# Altium schematic sheet PX4FMUv2.3_SCH4.SchDoc
size A4
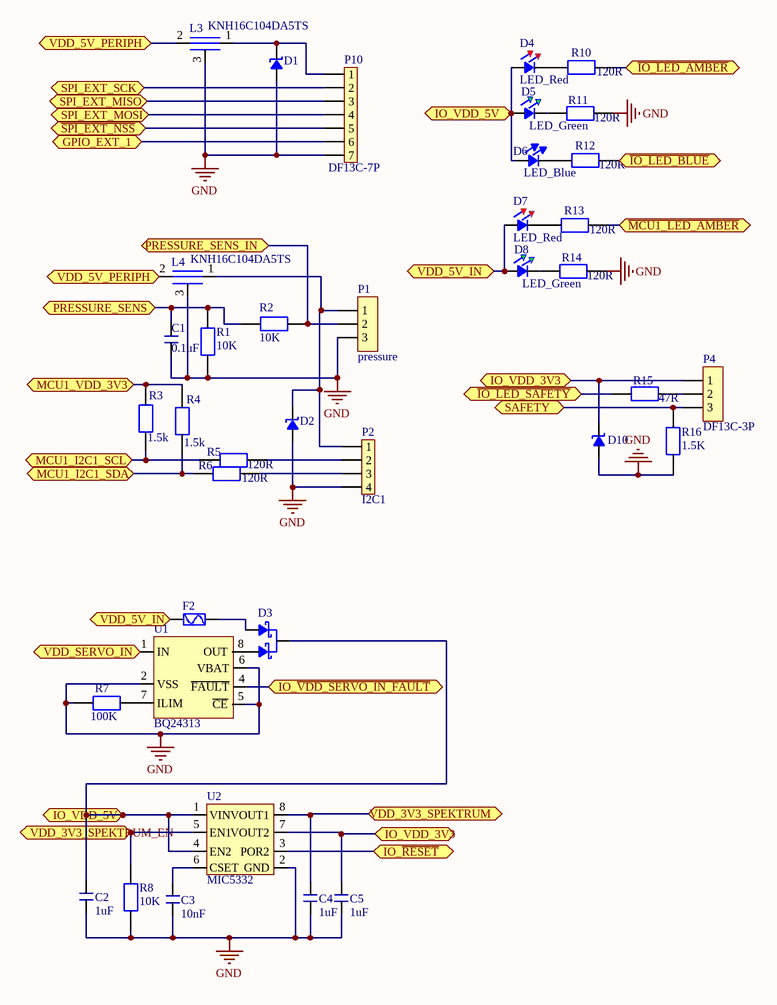
[diagram p0: PX4FMUv2.3_SCH4.SchDoc]

## Parts
C1  0.1uF  [C 0402]
C2  1uF  [C 0603_L]
C3  10nF  [C 0402]
C4  1uF  [C 0603_L]
C5  1uF  [C 0603_L]
D1  PESD0402-140  [0402-TVS]  (value not drawn)
D2  PESD0402-140  [0402-TVS]  (value not drawn)
D3  PMEG2005CT  [SOT23]  (value not drawn)
D4  LED_Red  [LED 0603R]
D5  LED_Green  [LED 0603G]
D6  LED_Blue  [LED 0603B]
D7  LED_Red  [LED 0603R]
D8  LED_Green  [LED 0603G]
D10  PESD0402-140  [0402-TVS]  (value not drawn)
F2  0ZCA0035FF2G  [PTC-1206]  (value not drawn)
L3  KNH16C104DA5TS  [KYOCERA-KNH16-DA]
L4  KNH16C104DA5TS  [KYOCERA-KNH16-DA]
P1  pressure  [MX 1.25-LS-3P]
P2  I2C1  [MX 1.25-LS-4P]
P4  DF13C-3P  [MX 1.25-LS-3P]
P10  DF13C-7P  [MX 1.25-LS-7P]
R1  10K  [0402R]
R2  10K  [0402R]
R3  1.5k  [0402R]
R4  1.5k  [0402R]
R5  120R  [0402R]
R6  120R  [0402R]
R7  100K  [0402R]
R8  10K  [0402R]
R10  120R  [0402R]
R11  120R  [0402R]
R12  120R  [0402R]
R13  120R  [0402R]
R14  120R  [0402R]
R15  47R  [0402R]
R16  1.5K  [0402R]
U1  BQ24313  [QFN8]
U2  MIC5332  [QFN8]

## Ports
GPIO_EXT_1 (bidir), IO_VDD_3V3 (bidir), IO_VDD_5V (bidir), IO_~{RESET} (bidir), IO_~{VDD_SERVO_IN_FAULT} (bidir), MCU1_I2C1_SCL (bidir), MCU1_I2C1_SDA (bidir), MCU1_VDD_3V3 (bidir), PRESSURE_SENS (bidir), PRESSURE_SENS_IN (bidir), SAFETY (bidir), SPI_EXT_MISO (bidir), SPI_EXT_MOSI (bidir), SPI_EXT_SCK (bidir), VDD_3V3_SPEKTRUM (bidir), VDD_3V3_SPEKTRUM_EN (bidir), VDD_5V_IN (bidir), VDD_5V_PERIPH (bidir), VDD_SERVO_IN (bidir), ~{IO_LED_AMBER} (bidir), ~{IO_LED_BLUE} (bidir), ~{IO_LED_SAFETY} (bidir), ~{MCU1_LED_AMBER} (bidir), ~{SPI_EXT_NSS} (bidir)

## Nets
GND: C1.2 C2.2 C3.2 C4.2 C5.2 D1.1 D2.1 D10.1 L3.3 L4.3 P1.3 P2.4 P10.7 R1.2 R7.2 R8.2 R11.1 R14.1 R16.2 U1.2(VSS) U1.5(~{CE}) U1.6(VBAT) U2.2(GND)
GPIO_EXT_1: P10.6 ; port GPIO_EXT_1
~{IO_LED_AMBER}: R10.2 ; port ~{IO_LED_AMBER}
~{IO_LED_BLUE}: R12.1 ; port ~{IO_LED_BLUE}
~{IO_LED_SAFETY}: R15.2 ; port ~{IO_LED_SAFETY}
IO_~{RESET}: U2.3(POR2) ; port IO_~{RESET}
IO_~{VDD_SERVO_IN_FAULT}: U1.4(~{FAULT}) ; port IO_~{VDD_SERVO_IN_FAULT}
IO_VDD_3V3: C5.1 D10.2 P4.1 U2.7(VOUT2) ; port IO_VDD_3V3
IO_VDD_5V: C2.1 D3.3 D4.3 D5.3 D6.3 U2.1(VIN) U2.4(EN2) ; port IO_VDD_5V
~{MCU1_LED_AMBER}: R13.2 ; port ~{MCU1_LED_AMBER}
MCU1_I2C1_SCL: R3.1 R5.2 ; port MCU1_I2C1_SCL
MCU1_I2C1_SDA: R4.1 R6.2 ; port MCU1_I2C1_SDA
MCU1_VDD_3V3: R3.2 R4.2 ; port MCU1_VDD_3V3
PRESSURE_SENS: C1.1 R1.1 R2.1 ; port PRESSURE_SENS
PRESSURE_SENS_IN: P1.2 R2.2 ; port PRESSURE_SENS_IN
~{SPI_EXT_NSS}: P10.5 ; port ~{SPI_EXT_NSS}
SAFETY: P4.3 R16.1 ; port SAFETY
SPI_EXT_MISO: P10.3 ; port SPI_EXT_MISO
SPI_EXT_MOSI: P10.4 ; port SPI_EXT_MOSI
SPI_EXT_SCK: P10.2 ; port SPI_EXT_SCK
VDD_3V3_SPEKTRUM: C4.1 U2.8(VOUT1) ; port VDD_3V3_SPEKTRUM
VDD_3V3_SPEKTRUM_EN: R8.1 U2.5(EN1) ; port VDD_3V3_SPEKTRUM_EN
VDD_5V_IN: D7.3 D8.3 F2.4 ; port VDD_5V_IN
VDD_5V_PERIPH: L3.2 L4.2 ; port VDD_5V_PERIPH
VDD_SERVO_IN: U1.1(IN) ; port VDD_SERVO_IN
NetC3_1: C3.1 U2.6(CSET)
NetD1_2: D1.2 L3.1 P10.1
NetD2_2: D2.2 L4.1 P1.1 P2.1
NetD3_1: D3.1 F2.5
NetD3_2: D3.2 U1.8(OUT)
NetD4_4: D4.4 R10.1
NetD5_4: D5.4 R11.2
NetD6_4: D6.4 R12.2
NetD7_4: D7.4 R13.1
NetD8_4: D8.4 R14.2
NetP2_2: P2.2 R5.1
NetP2_3: P2.3 R6.1
NetP4_2: P4.2 R15.1
NetR7_1: R7.1 U1.7(ILIM)

## Library data of the parts
C1 C3 = CAP_0402
C2 C4 C5 = CAP_0603
P1 = DF13C-3P
P2 = DF13C-4P
R1-R8 R10-R16 = Res_0402